# Altium schematic sheet LDO_LM_POWER_two_78.SchDoc
size A4
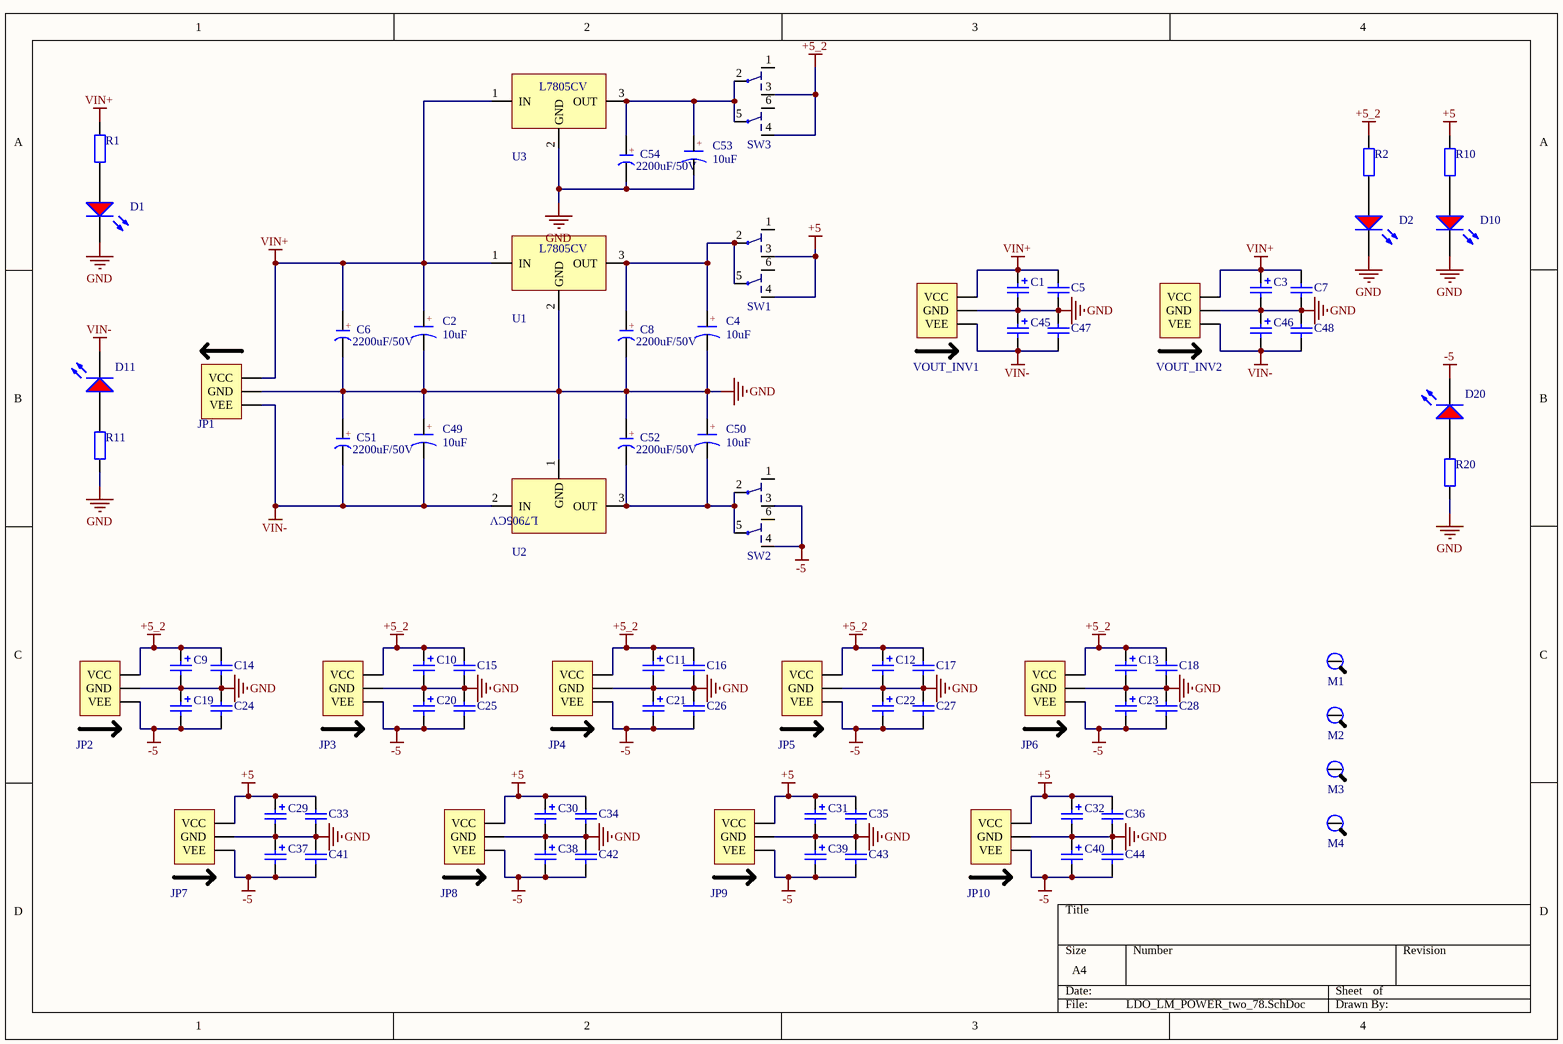
[diagram p0: LDO_LM_POWER_two_78.SchDoc]

## Parts
C1  10uF (106) ±10% 16V  [CASE-A_3216]  (value not drawn)
C2  value 10uF  [226C]  (hidden comment: CAP+)
C3  10uF (106) ±10% 16V  [CASE-A_3216]  (value not drawn)
C4  value 10uF  [226C]  (hidden comment: CAP+)
C5  100nF (104) 10% 50V  [0603_C]  (value not drawn)
C6  2200uF/50V  [2200uF/50V]
C7  100nF (104) 10% 50V  [0603_C]  (value not drawn)
C8  2200uF/50V  [2200uF/50V]
C9  10uF (106) ±10% 16V  [CASE-A_3216]  (value not drawn)
C10  10uF (106) ±10% 16V  [CASE-A_3216]  (value not drawn)
C11  10uF (106) ±10% 16V  [CASE-A_3216]  (value not drawn)
C12  10uF (106) ±10% 16V  [CASE-A_3216]  (value not drawn)
C13  10uF (106) ±10% 16V  [CASE-A_3216]  (value not drawn)
C14  100nF (104) 10% 50V  [0603_C]  (value not drawn)
C15  100nF (104) 10% 50V  [0603_C]  (value not drawn)
C16  100nF (104) 10% 50V  [0603_C]  (value not drawn)
C17  100nF (104) 10% 50V  [0603_C]  (value not drawn)
C18  100nF (104) 10% 50V  [0603_C]  (value not drawn)
C19  10uF (106) ±10% 16V  [CASE-A_3216]  (value not drawn)
C20  10uF (106) ±10% 16V  [CASE-A_3216]  (value not drawn)
C21  10uF (106) ±10% 16V  [CASE-A_3216]  (value not drawn)
C22  10uF (106) ±10% 16V  [CASE-A_3216]  (value not drawn)
C23  10uF (106) ±10% 16V  [CASE-A_3216]  (value not drawn)
C24  100nF (104) 10% 50V  [0603_C]  (value not drawn)
C25  100nF (104) 10% 50V  [0603_C]  (value not drawn)
C26  100nF (104) 10% 50V  [0603_C]  (value not drawn)
C27  100nF (104) 10% 50V  [0603_C]  (value not drawn)
C28  100nF (104) 10% 50V  [0603_C]  (value not drawn)
C29  10uF (106) ±10% 16V  [CASE-A_3216]  (value not drawn)
C30  10uF (106) ±10% 16V  [CASE-A_3216]  (value not drawn)
C31  10uF (106) ±10% 16V  [CASE-A_3216]  (value not drawn)
C32  10uF (106) ±10% 16V  [CASE-A_3216]  (value not drawn)
C33  100nF (104) 10% 50V  [0603_C]  (value not drawn)
C34  100nF (104) 10% 50V  [0603_C]  (value not drawn)
C35  100nF (104) 10% 50V  [0603_C]  (value not drawn)
C36  100nF (104) 10% 50V  [0603_C]  (value not drawn)
C37  10uF (106) ±10% 16V  [CASE-A_3216]  (value not drawn)
C38  10uF (106) ±10% 16V  [CASE-A_3216]  (value not drawn)
C39  10uF (106) ±10% 16V  [CASE-A_3216]  (value not drawn)
C40  10uF (106) ±10% 16V  [CASE-A_3216]  (value not drawn)
C41  100nF (104) 10% 50V  [0603_C]  (value not drawn)
C42  100nF (104) 10% 50V  [0603_C]  (value not drawn)
C43  100nF (104) 10% 50V  [0603_C]  (value not drawn)
C44  100nF (104) 10% 50V  [0603_C]  (value not drawn)
C45  10uF (106) ±10% 16V  [CASE-A_3216]  (value not drawn)
C46  10uF (106) ±10% 16V  [CASE-A_3216]  (value not drawn)
C47  100nF (104) 10% 50V  [0603_C]  (value not drawn)
C48  100nF (104) 10% 50V  [0603_C]  (value not drawn)
C49  value 10uF  [226C]  (hidden comment: CAP+)
C50  value 10uF  [226C]  (hidden comment: CAP+)
C51  2200uF/50V  [2200uF/50V]
C52  2200uF/50V  [2200uF/50V]
C53  value 10uF  [226C]  (hidden comment: CAP+)
C54  2200uF/50V  [2200uF/50V]
D1  红灯 0603  [0603_LED_S1]  (value not drawn)
D2  红灯 0603  [0603_LED_S1]  (value not drawn)
D10  红灯 0603  [0603_LED_S1]  (value not drawn)
D11  红灯 0603  [0603_LED_S1]  (value not drawn)
D20  红灯 0603  [0603_LED_S1]  (value not drawn)
JP1  HDR-1X3  [Power_IN_3.81-3P]  (value not drawn)
JP2  HDR-1X3  [Power_OUT_3.81-3P]  (value not drawn)
JP3  HDR-1X3  [Power_OUT_3.81-3P]  (value not drawn)
JP4  HDR-1X3  [Power_OUT_3.81-3P]  (value not drawn)
JP5  HDR-1X3  [Power_OUT_3.81-3P]  (value not drawn)
JP6  HDR-1X3  [Power_OUT_3.81-3P]  (value not drawn)
JP7  HDR-1X3  [Power_OUT_3.81-3P]  (value not drawn)
JP8  HDR-1X3  [Power_OUT_3.81-3P]  (value not drawn)
JP9  HDR-1X3  [Power_OUT_3.81-3P]  (value not drawn)
JP10  HDR-1X3  [Power_OUT_3.81-3P]  (value not drawn)
M1  M3  [M3x10_L]  (value not drawn)
M2  M3  [M3x10_L]  (value not drawn)
M3  M3  [M3x10_L]  (value not drawn)
M4  M3  [M3x10_L]  (value not drawn)
R1  10KΩ (1002) ±1%  [0603_R]  (value not drawn)
R2  10KΩ (1002) ±1%  [0603_R]  (value not drawn)
R10  10KΩ (1002) ±1%  [0603_R]  (value not drawn)
R11  10KΩ (1002) ±1%  [0603_R]  (value not drawn)
R20  10KΩ (1002) ±1%  [0603_R]  (value not drawn)
SW1  SWITCH  [六脚自锁开关]  (value not drawn)
SW2  SWITCH  [六脚自锁开关]  (value not drawn)
SW3  SWITCH  [六脚自锁开关]  (value not drawn)
U1  7805  [TO-220]  (value not drawn)
U2  7905  [TO-220]  (value not drawn)
U3  7805  [TO-220]  (value not drawn)
VOUT_INV1  HDR-1X3  [Power_OUT_3.81-3P]  (value not drawn)
VOUT_INV2  HDR-1X3  [Power_OUT_3.81-3P]  (value not drawn)

## Nets
+5: C29.1 C30.1 C31.1 C32.1 C33.2 C34.2 C35.2 C36.2 JP7.3(VCC) JP8.3(VCC) JP9.3(VCC) JP10.3(VCC) R10.2 SW1.3 SW1.4
+5_2: C9.1 C10.1 C11.1 C12.1 C13.1 C14.2 C15.2 C16.2 C17.2 C18.2 JP2.3(VCC) JP3.3(VCC) JP4.3(VCC) JP5.3(VCC) JP6.3(VCC) R2.2 SW3.3 SW3.4
-5: C19.2 C20.2 C21.2 C22.2 C23.2 C24.1 C25.1 C26.1 C27.1 C28.1 C37.2 C38.2 C39.2 C40.2 C41.1 C42.1 C43.1 C44.1 D20.K JP2.1(VEE) JP3.1(VEE) JP4.1(VEE) JP5.1(VEE) JP6.1(VEE) JP7.1(VEE) JP8.1(VEE) JP9.1(VEE) JP10.1(VEE) SW2.3 SW2.4
GND: C1.2 C2.2(K) C3.2 C4.2(K) C5.1 C6.2(K) C7.1 C8.2(K) C9.2 C10.2 C11.2 C12.2 C13.2 C14.1 C15.1 C16.1 C17.1 C18.1 C19.1 C20.1 C21.1 C22.1 C23.1 C24.2 C25.2 C26.2 C27.2 C28.2 C29.2 C30.2 C31.2 C32.2 C33.1 C34.1 C35.1 C36.1 C37.1 C38.1 C39.1 C40.1 C41.2 C42.2 C43.2 C44.2 C45.1 C46.1 C47.2 C48.2 C49.1(A) C50.1(A) C51.1(A) C52.1(A) C53.2(K) C54.2(K) D1.K D2.K D10.K JP1.2(GND) JP2.2(GND) JP3.2(GND) JP4.2(GND) JP5.2(GND) JP6.2(GND) JP7.2(GND) JP8.2(GND) JP9.2(GND) JP10.2(GND) R11.1 R20.1 U1.2(GND) U2.1(GND) U3.2(GND) VOUT_INV1.2(GND) VOUT_INV2.2(GND)
VIN+: C1.1 C2.1(A) C3.1 C5.2 C6.1(A) C7.2 JP1.1(VCC) R1.2 U1.1(IN) U3.1(IN) VOUT_INV1.3(VCC) VOUT_INV2.3(VCC)
VIN-: C45.2 C46.2 C47.1 C48.1 C49.2(K) C51.2(K) D11.K JP1.3(VEE) U2.2(IN) VOUT_INV1.1(VEE) VOUT_INV2.1(VEE)
NetC4_1: C4.1(A) C8.1(A) SW1.2 SW1.5 U1.3(OUT)
NetC50_2: C50.2(K) C52.2(K) SW2.2 SW2.5 U2.3(OUT)
NetC53_1: C53.1(A) C54.1(A) SW3.2 SW3.5 U3.3(OUT)
NetD1_A: D1.A R1.1
NetD2_A: D2.A R2.1
NetD10_A: D10.A R10.1
NetD11_A: D11.A R11.2
NetD20_A: D20.A R20.2

Not connected (* = marked no-connect by the designer): M1 1; M2 1; M3 1; M4 1; SW1 1 6; SW2 1 6; SW3 1 6

## Notes on the sheet
- (in symbol 0CAP+) +
- (in symbol CAP_2200uF/50V) +
- (in symbol IC_7805) L7805CV
- (in symbol IC_7905) L7905CV

## Library data of the parts
C1 C3 C9-C13 C19-C23 C29-C32 C37-C40 C45 C46 = 3216 10uF (106) 10% 16V: 钽电容; ComponentLink1Description: 供应商链接; ComponentLink1URL: http://www.szlcsc.com/product/details_7643.html; Package: 3216; Supplier: LC; SuppliersPartNumber: C7171
C2 C4 C49 C50 C53 = 0CAP+: 贴片钽电容
C5 C7 C14-C18 C24-C28 C33-C36 C41-C44 C47 C48 = 0603 100nF (104) 10% 50V: 贴片电容; ComponentLink1Description: 供应商链接; ComponentLink1URL: http://www.szlcsc.com/product/details_15331.html; Package: 0603; Supplier: LC; SuppliersPartNumber: C14663
C6 C8 C51 C52 C54 = CAP_2200uF/50V: 直插电解电容; Value: 2200uF/50V
D1 D2 D10 D11 D20 = 0603 红灯: 发光二极管; ComponentLink1Description: 供应商链接; ComponentLink1URL: http://www.szlcsc.com/product/details_2659.html; Package: 0603; Supplier: LC; SuppliersPartNumber: C2286
JP1 = PORT_Power_IN3: 3P接插件,模块双电源供电口; 版权归属: 源创客; BOM名称: 3P接插件; 学习资源: www.ooocke.com
JP2-JP10 VOUT_INV1 VOUT_INV2 = PORT_Power_OUT3: 3P接插件,双电源供电口; 版权归属: 源创客; BOM名称: 3P接插件; 学习资源: www.ooocke.com
M1-M4 = ELSE_M3_screw: 螺丝
R1 R2 R10 R11 R20 = 0603 10KΩ (1002) 1%: 贴片电阻; ComponentLink1Description: 供应商链接; ComponentLink1URL: http://www.szlcsc.com/product/details_26547.html; Package: 0603; Supplier: LC; SuppliersPartNumber: C25804
SW1-SW3 = SWITCH_六脚自锁开关
U1 U3 = IC_7805: 3端稳压
U2 = IC_7905: 3端稳压